# Altium schematic sheet Microcontroller.SchDoc
size A4
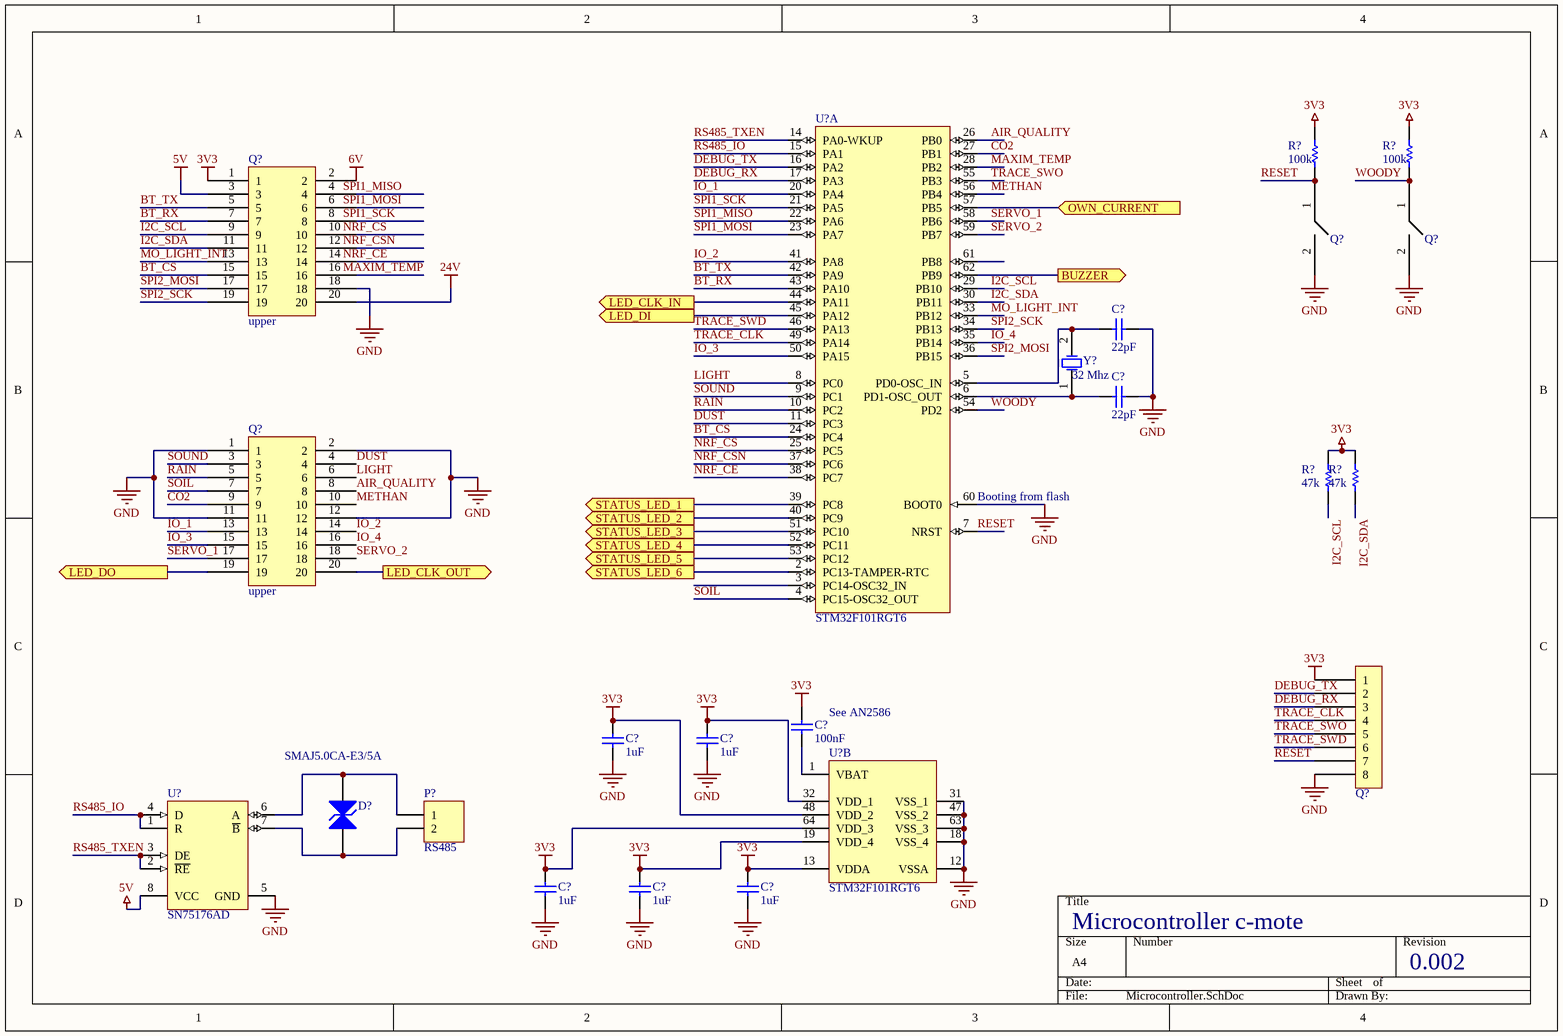
[diagram p0: Microcontroller.SchDoc]

## Parts
(Parts that share a designator on the sheet are numbered #1, #2 ... from top to bottom, then left to right.)
C?#1  value 22pF  [CAPC0805(2012)100_M]  (hidden comment: CAP 22pF 10V 0805(2012))
C?#2  value 22pF  [CAPC0805(2012)100_M]  (hidden comment: CAP 22pF 10V 0805(2012))
C?#3  value 100nF  [CAPC0805(2012)100_M]  (hidden comment: CAP 22pF 10V 0805(2012))
C?#4  value 1uF  [CAPC0805(2012)100_M]  (hidden comment: CAP 22pF 10V 0805(2012))
C?#5  value 1uF  [CAPC0805(2012)100_M]  (hidden comment: CAP 22pF 10V 0805(2012))
C?#6  value 1uF  [CAPC0805(2012)100_M]  (hidden comment: CAP 22pF 10V 0805(2012))
C?#7  value 1uF  [CAPC0805(2012)100_M]  (hidden comment: CAP 22pF 10V 0805(2012))
C?#8  value 1uF  [CAPC0805(2012)100_M]  (hidden comment: CAP 22pF 10V 0805(2012))
D?  SMAJ5.0CA-E3/5A  [VISH-DO-214AC-2_N]
P?  RS485  [HDR1X2]
Q?#1  SMD Button  [SMD Button Right Angel]  (value not drawn)
Q?#2  SMD Button  [SMD Button Right Angel]  (value not drawn)
Q?#3  upper  [HEADER_2x10_SMD_1.27mm_TOP]
Q?#4  upper  [HEADER_2x10_SMD_1.27mm_TOP]
Q?#5  Program and debug interface  [Program and debug]  (value not drawn)
R?#1  100k  [RESC0805(2012)_L]
R?#2  100k  [RESC0805(2012)_L]
R?#3  47k  [RESC0805(2012)_L]
R?#4  47k  [RESC0805(2012)_L]
U?#1  STM32F101RGT6  [STM-LQFP64_V]  (part A of 2)
U?#2  STM32F101RGT6  [STM-LQFP64_V]  (part B of 2)
U?#3  SN75176AD  [D8_M]
Y?  32 Mhz  [R38]

## Ports
BUZZER (out), LED_CLK_IN (out), LED_CLK_OUT (out), LED_DI (out), LED_DO (out), OWN_CURRENT (in), STATUS_LED_1 (out), STATUS_LED_2 (out), STATUS_LED_3 (out), STATUS_LED_4 (out), STATUS_LED_5 (out), STATUS_LED_6 (out)

## Nets
3V3: C?#3.1 C?#4.2 C?#5.2 C?#6.2 C?#7.2 C?#8.2 Q?#3.1 Q?#5.1 R?#1.2 R?#2.2 R?#3.1 R?#4.1 U?#2.13(VDDA) U?#2.19(VDD_4) U?#2.32(VDD_1) U?#2.48(VDD_2) U?#2.64(VDD_3)
5V: Q?#3.3 U?#3.8(VCC)
6V: Q?#3.2
24V: Q?#3.20
GND: C?#1.1 C?#2.1 C?#4.1 C?#5.1 C?#6.1 C?#7.1 C?#8.1 Q?#1.2 Q?#2.2 Q?#3.18 Q?#4.1 Q?#4.2 Q?#4.11 Q?#4.12 Q?#5.8 U?#1.60(BOOT0) U?#2.12(VSSA) U?#2.18(VSS_4) U?#2.31(VSS_1) U?#2.47(VSS_2) U?#2.63(VSS_3) U?#3.5(GND)
AIR_QUALITY: Q?#4.8 U?#1.26(PB0)
BT_CS: Q?#3.15 U?#1.24(PC4)
BT_RX: Q?#3.7 U?#1.43(PA10)
BT_TX: Q?#3.5 U?#1.42(PA9)
BUZZER: U?#1.62(PB9) ; port BUZZER
CO2: Q?#4.9 U?#1.27(PB1)
DEBUG_RX: Q?#5.3 U?#1.17(PA3)
DEBUG_TX: Q?#5.2 U?#1.16(PA2)
DUST: Q?#4.4 U?#1.11(PC3)
I2C_SCL: Q?#3.9 R?#3.2 U?#1.29(PB10)
I2C_SDA: Q?#3.11 R?#4.2 U?#1.30(PB11)
IO_1: Q?#4.13 U?#1.20(PA4)
IO_2: Q?#4.14 U?#1.41(PA8)
IO_3: Q?#4.15 U?#1.50(PA15)
IO_4: Q?#4.16 U?#1.35(PB14)
LED_CLK_IN: U?#1.44(PA11) ; port LED_CLK_IN
LED_CLK_OUT: Q?#4.20 ; port LED_CLK_OUT
LED_DI: U?#1.45(PA12) ; port LED_DI
LED_DO: Q?#4.19 ; port LED_DO
LIGHT: Q?#4.6 U?#1.8(PC0)
MAXIM_TEMP: U?#1.28(PB2)
METHAN: Q?#4.10 U?#1.56(PB4)
MO_LIGHT_INT: Q?#3.13 U?#1.33(PB12)
NRF_CE: U?#1.38(PC7)
NRF_CS: U?#1.25(PC5)
NRF_CSN: U?#1.37(PC6)
OWN_CURRENT: U?#1.57(PB5) ; port OWN_CURRENT
RAIN: Q?#4.5 U?#1.10(PC2)
RESET: Q?#1.1 Q?#5.7 R?#1.1 U?#1.7(NRST)
RS485_IO: U?#1.15(PA1) U?#3.1(R) U?#3.4(D)
RS485_TXEN: U?#1.14(PA0-WKUP) U?#3.2(~{RE}) U?#3.3(DE)
SERVO_1: Q?#4.17 U?#1.58(PB6)
SERVO_2: Q?#4.18 U?#1.59(PB7)
SOIL: Q?#4.7 U?#1.4(PC15-OSC32_OUT)
SOUND: Q?#4.3 U?#1.9(PC1)
SPI1_MISO: U?#1.22(PA6)
SPI1_MOSI: U?#1.23(PA7)
SPI1_SCK: U?#1.21(PA5)
SPI2_MOSI: Q?#3.17 U?#1.36(PB15)
SPI2_SCK: Q?#3.19 U?#1.34(PB13)
STATUS_LED_1: U?#1.39(PC8) ; port STATUS_LED_1
STATUS_LED_2: U?#1.40(PC9) ; port STATUS_LED_2
STATUS_LED_3: U?#1.51(PC10) ; port STATUS_LED_3
STATUS_LED_4: U?#1.52(PC11) ; port STATUS_LED_4
STATUS_LED_5: U?#1.53(PC12) ; port STATUS_LED_5
STATUS_LED_6: U?#1.2(PC13-TAMPER-RTC) ; port STATUS_LED_6
TRACE_CLK: Q?#5.4 U?#1.49(PA14)
TRACE_SWD: Q?#5.6 U?#1.46(PA13)
TRACE_SWO: Q?#5.5 U?#1.55(PB3)
WOODY: Q?#2.1 R?#2.1 U?#1.54(PD2)
NetC?#1_2: C?#1.2 U?#1.5(PD0-OSC_IN) Y?.2(OSC2)
NetC?#2_2: C?#2.2 U?#1.6(PD1-OSC_OUT) Y?.1(OSC1)
NetC?#3_2: C?#3.2 U?#2.1(VBAT)
NetD?_1: D?.1(A1) P?.2 U?#3.7(~{B})
NetD?_2: D?.2(A2) P?.1 U?#3.6(A)

Not connected (* = marked no-connect by the designer): Q?#3 4 6 8 10 12 14 16; U?#1 3(PC14-OSC32_IN) 61(PB8)

## Notes on the sheet
- (near U?#1) Booting from flash
- (near C?#3) See AN2586
- Microcontroller c-mote
- 0.002
- Labels drawn without touching a wire or pin: MAXIM_TEMP, NRF_CE, NRF_CS, NRF_CSN, SPI1_MISO, SPI1_MOSI, SPI1_SCK

## Library data of the parts
C?#1-C?#8 = CMP-1036-01210-1: CAP 22pF 10V ±5% 0805 (2012 Metric) Thickness 1mm SMD; Case-EIA: 0805; Case-Metric: 2012; Max Thickness: 1 mm; Rated Voltage: 10 V; Tolerance: ±5%; Technology: SMT
D? = CMP-0548-00276-2: Transient Voltage Suppressor, 6.40 to 231 V, 5 V Stand-off Voltage, Bi-Directional, -55 to 155 degC, 2-pin DO-214AC, Pb-Free, Tape and Reel; Manufacturer: Vishay Semiconductor; PPPM (W): 400, 300; VBR Bi-Directional (V): 6.4 to 231; ID (uA): 1600; IFSM: 40 A; VWM (V): 5; RoHS: TRUE; Operating Junction and Storage Temperature Range: -55 to 150 degC; Packing: Tape and Reel; ComponentLink1URL: http://www.vishay.com/; Mounting Technology: Surface Mount; ComponentLink2URL: http://www.vishay.com/docs/88390/smaj50a.pdf; PartNumber: SMAJ5.0CA-E3/5A; PackageReference: DO-214AC-2; ComponentLink1Description: Manufacturer URL; ComponentLink3Description: Package Specification; ComponentLink2Description: Datasheet; PackageDescription: 2-Pin DO-214AC (SMA), Body 4.245 x 2.665 mm; DatasheetVersion: 12/8/2013; ComponentLink3URL: http://www.vishay.com/docs/88390/smaj50a.pdf; digikey: http://www.digikey.com/product-detail/en/SMAJ5.0CA-E3%2F61/SMAJ5.0CA-E3%2F61GICT-ND/1091642
P? = Header 2: Header, 2-Pin; LatestRevisionDate: 17-Jul-2002; LatestRevisionNote: Re-released for DXP Platform.; Publisher: Altium Limited
Q?#3 Q?#4 = c-moteconnector upper: c-mote upper connector
R?#1 R?#2 = CMP-1013-00122-1: 100K 0.125W 5% 0805 (2012 Metric)  SMD; Case-Metric: 2012; Case-EIA: 0805; Tolerance: 5 %; Technology: SMT; Value: 100k; Power: 0.125 W
R?#3 R?#4 = CMP-1013-00114-1: 47K 0.125W 5% 0805 (2012 Metric)  SMD; Case-Metric: 2012; Case-EIA: 0805; Tolerance: 5 %; Power: 0.125 W; Technology: SMT; Value: 47k
U?#1 U?#2 = CMP-0237-00281-2: ARM Cortex-M3 32-bit MCU, 1024 KB Flash, 80 KB Internal RAM, 51 I/Os, 64-pin LQFP, -40 to 85 degC, Tray; Internal RAM Size (kB): 80; FLASH Size (Prog) (kB): 1024; I/Os (High Current): 51; A/D Converter: 2x12-bit (16 Channels); D/A Converter: 2x12-bit (2 Channels); Supply Voltage(Vcc) min (V): 2; Operating Frequency(F) (Processor speed) (MHz): 36; ComponentLink2URL: http://www.st.com/st-web-ui/static/active/en/resource/technical/document/datasheet/CD00253739.pdf; Packing: Tray; PartNumber: STM32F101RGT6; ComponentLink3Description: Package Specification; PackageDescription: 64-Pin Low Profile Quad Flat Package, 10 x 10 mm Body, 0.5 mm Pitch; ComponentLink2Description: Datasheet; PackageReference: LQFP64; ComponentLink1URL: http://www.st.com/web/en/home.html; Core: ARM Cortex-M3; Mounting Technology: Surface Mount; PackageVersion: Rev. 4, 06/2013; ComponentLink1Description: Manufacturer URL; ComponentLink3URL: http://www.st.com/st-web-ui/static/active/en/resource/technical/document/datasheet/DM00037051.pdf; DatasheetVersion: Rev. 2
U?#3 = CMP-0310-00139-1: Differential Bus Transceiver, 1 TX / 1 RX, 5V, 0 to 70 degC, 8-Pin SOIC (D), Green (RoHS & no Sb/Br); Manufacturer: Texas Instruments; Drivers Per Package: 1; Rating: Catalog; Supply Voltage(s)(V): 5; ESD(kV): 2; ICC(Max)(mA): 50; SubFamily: RS-422; Mounting Technology: Surface Mount; Code_JEDEC: MS-012AA; PartNumber: SN75176AD; PackageVersion: revM, Jun-2011; PackageReference: D8; Eco-Plan: Green (RoHS & no Sb/Br); Receivers Per Package: 1; ComponentLink1URL: http://www.ti.com/general/docs/lit/getliterature.tsp?genericPartNumber=SN75176A&fileType=pdf; ComponentLink2Description: Package Specification; PackageDescription: 8-Pin Plastic Small Outline Integrated Circuit, 4.9 x 3.9 mm, Pitch 1.27 mm Pitch; ComponentLink2URL: http://www.ti.com/lit/ml/msoi002j/msoi002j.pdf; ComponentLink1Description: Datasheet; DatasheetVersion: SLLS100A; # of TX/RX: 1 TX / 1 RX; Isolated: No; Footprint: SN75176
Y? = XTAL: Crystal Oscillator; Published: 8-Jun-2000; LatestRevisionDate: 17-Jul-2002; LatestRevisionNote: Re-released for DXP Platform.; PackageReference: R38; Publisher: Altium Limited; PackageDescription: Crystal, Thru-Hole; 2 Leads; Body 3.1 x 8.2 mm (Dia.xH); Frequency: 32 Mhz
Q?#1 Q?#2 = SMD Button: AlieX: http://www.aliexpress.com/item/Original-new-100-100pcs-Little-turtle-button-switch-2-pin-SMD-tact-switch-with-fixed-point/1969145919.html